# Altium schematic sheet Main_Buck.SchDoc: Buck Converter 60W 20V
size A4; Date: 25 FEB 2024; Author: Arturo S. Bayangos; Revision: V1.0; SheetNumber: 2; SheetTotal: 4
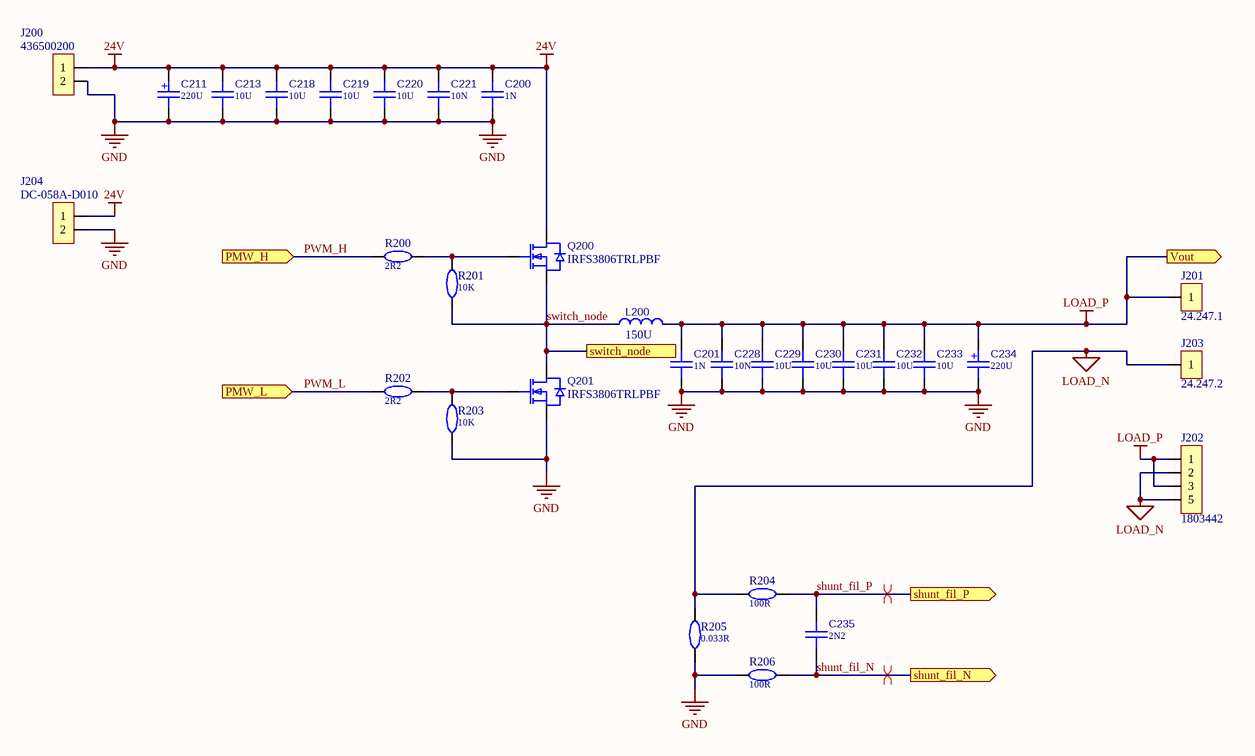
[diagram p0: Main_Buck.SchDoc]

## Parts
C200  value 1N  [CAP_0402]  (hidden comment: CAPACITOR)
C201  value 1N  [CAP_0402]  (hidden comment: CAPACITOR)
C211  value 220U  [CAP_SMD_UUD1H221MNL1GS]  (hidden comment: CAPACITOR_POLARIZED)
C213  value 10U  [CAP_1210]  (hidden comment: CAPACITOR)
C218  value 10U  [CAP_1210]  (hidden comment: CAPACITOR)
C219  value 10U  [CAP_1210]  (hidden comment: CAPACITOR)
C220  value 10U  [CAP_1210]  (hidden comment: CAPACITOR)
C221  value 10N  [CAP_0402]  (hidden comment: CAPACITOR)
C228  value 10N  [CAP_0402]  (hidden comment: CAPACITOR)
C229  value 10U  [CAP_1210]  (hidden comment: CAPACITOR)
C230  value 10U  [CAP_1210]  (hidden comment: CAPACITOR)
C231  value 10U  [CAP_1210]  (hidden comment: CAPACITOR)
C232  value 10U  [CAP_1210]  (hidden comment: CAPACITOR)
C233  value 10U  [CAP_1210]  (hidden comment: CAPACITOR)
C234  value 220U  [CAP_SMD_UUD1H221MNL1GS]  (hidden comment: CAPACITOR_POLARIZED)
C235  value 2N2  [CAP_0603]  (hidden comment: CAPACITOR)
J200  value 436500200  [CON_436500200]  (hidden comment: JACK_2P)
J201  value 24.247.1  [BANANA_JACK_RED_24.247.1]  (hidden comment: JACK_1P)
J202  value 1803442  [CON_1803442]  (hidden comment: JACK_4P)
J203  value 24.247.2  [BANANA_JACK_BLACK_24.247.2]  (hidden comment: JACK_1P)
J204  value DC-058A-D010  [CON_DC-058A-D010]  (hidden comment: JACK_2P)
L200  value 150U  [IND_74437429203151]  (hidden comment: INDUCTOR)
Q200  value IRFS3806TRLPBF  [D2PAK]  (hidden comment: MOSFET_NCHANNEL)
Q201  value IRFS3806TRLPBF  [D2PAK]  (hidden comment: MOSFET_NCHANNEL)
R200  value 2R2  [RES_0603]  (hidden comment: RESISTOR)
R201  value 10K  [RES_0603]  (hidden comment: RESISTOR)
R202  value 2R2  [RES_0603]  (hidden comment: RESISTOR)
R203  value 10K  [RES_0603]  (hidden comment: RESISTOR)
R204  value 100R  [RES_0603]  (hidden comment: RESISTOR)
R205  value 0.033R  [RES_1210]  (hidden comment: RESISTOR)
R206  value 100R  [RES_0603]  (hidden comment: RESISTOR)

## Ports
PMW_H (in), PMW_L (in), shunt_fil_N (out), shunt_fil_P (out), switch_node, Vout (out)

## Nets
24V: C200.2 C211.1 C213.1 C218.1 C219.1 C220.1 C221.2 J200.1 J204.1 Q200.4(D)
GND: C200.1 C201.2 C211.2 C213.2 C218.2 C219.2 C220.2 C221.1 C228.1 C229.2 C230.2 C231.2 C232.2 C233.2 C234.2 J200.2 J204.2 Q201.3(S) R203.1 R205.1 R206.1
LOAD_N: J202.2 J202.4(5) J203.1 R204.1 R205.2
LOAD_P: C201.1 C228.2 C229.1 C230.1 C231.1 C232.1 C233.1 C234.1 J201.1 J202.1 J202.3 L200.2 ; port Vout
PWM_H: R200.1 ; port PMW_H
PWM_L: R202.1 ; port PMW_L
shunt_fil_N: C235.1 R206.2 ; port shunt_fil_N
shunt_fil_P: C235.2 R204.2 ; port shunt_fil_P
switch_node: L200.1 Q200.3(S) Q201.4(D) R201.1 ; port switch_node
NetQ200_1: Q200.1(G) R200.2 R201.2
NetQ201_1: Q201.1(G) R202.2 R203.2

## Layout directives
differential pair: shunt_fil_N, shunt_fil_P

## Notes on the sheet
- Title:
- Revision:
- Variant:
- Size:
- Author:
- A4
- ASB
- Date:
- Sheet:
- of
- (in symbol UUD1H221MNL1GS) +

## Library data of the parts
C200 C201 = UMF105B7102KVHF: CAP 1N 0402 X7R 50V 10%; Manifacturer: Taiyo Yuden; Part Number: UMF105B7102KVHF; ComponentLink1Description: Datasheet; ComponentLink1URL: https://datasheet.lcsc.com/lcsc/1912111437_Taiyo-Yuden-UMF105B7102KVHF_C386104.pdf; ComponentLink2Description: Characteristics; ComponentLink2URL: Datasheets\Capacitors\UMF105B7102KVHF_TaiyoYuden.pdf; Package: 0402
C211 C234 = UUD1H221MNL1GS: CAP 220U SMD_D10mm_L10mm ELEC 50V 20%; Manifacturer: Nichicon; Part Number: UUD1H221MNL1GS; ComponentLink1Description: Datasheet; ComponentLink2Description: Characteristics; Package: SMD_D10mm_L10mm
C213 C218-C220 C229-C233 = UMK325AB7106KM-T: CAP 10U 1210 X7R 50V 10%; Manifacturer: Taiyo Yuden; Part Number: UMK325AB7106KM-T; ComponentLink1Description: Datasheet; ComponentLink1URL: https://datasheet.lcsc.com/lcsc/2211282230_Taiyo-Yuden-UMK325AB7106KM-T_C386167.pdf; ComponentLink2Description: Characteristics; ComponentLink2URL: Datasheets\Capacitors\UMK325AB7106KM-T_TaiyoYuden_Char.pdf; Package: 1210
C221 C228 = UMF105B7103KVHF: CAP 10N 0402 X7R 50V 10%; Manifacturer: Taiyo Yuden; Part Number: UMF105B7103KVHF; ComponentLink1Description: Datasheet; ComponentLink1URL: https://datasheet.lcsc.com/lcsc/1912111437_Taiyo-Yuden-UMF105B7103KVHF_C386105.pdf; ComponentLink2Description: Characteristics; ComponentLink2URL: Datasheets\Capacitors\UMF105B7103KVHF_TaiyoYuden.pdf; Package: 0402
C235 = C1608C0G2E222JT000N: CAP 2N2 0603 NPO 250V 5%; Manifacturer: TDK; Part Number: C1608C0G2E222JT000N; ComponentLink1Description: Datasheet; ComponentLink1URL: https://datasheet.lcsc.com/lcsc/2304140030_TDK-C1608C0G2E222JT000N_C694281.pdf; ComponentLink2Description: Characteristics; Package: 0603
J200 = 436500200: RECEP 436500200 TH 3mm HORIZ; Pitch: NA; Voltage: 600V; Current: 8.5A; Structure: RERCEP 2WIRE HORIZ; Manifacturer: MOLEX; ComponentLink1Description: Datasheet; ComponentLink1URL: https://datasheet.lcsc.com/lcsc/2305301754_MOLEX-436500200_C192562.pdf; Part Number: 436500200; Package: TH; Supported protocol: NA
J201 = 24.247.1: JACK  24.247.1 TH 4mm  VERT RED; Pitch: NA; Voltage: 60V; Current: 32A; Structure: VERT RED BANANA JACK; Manifacturer: Changzhou Amass Elec; ComponentLink1Description: Datasheet; ComponentLink1URL: https://www.lcsc.com/product-detail/Banana-Connectors-Alligator-Clips_Changzhou-Amass-Elec-24-247-2_C106272.html; Part Number: 24.247.1; Package: TH; Supported protocol: NA
J202 = 1803442: RECEP 1803442 TH 3.81mm HORIZ; Voltage: 160V; Current: 8A; Structure: RECEP 4WIRE VERT; Supported protocol: NA; Manifacturer: Phoenix Contact; ComponentLink1Description: Datasheet; ComponentLink1URL: https://datasheet.lcsc.com/lcsc/2001071235_Phoenix-Contact-1803442_C480518.pdf; Part Number: 1803442; Package: TH; Pitch: 3.81mm
J203 = 24.247.2: JACK  24.247.2 TH 4mm  VERT BLACK; Pitch: NA; Voltage: 60V; Current: 32A; Structure: VERT BLACK BANANA JACK; Manifacturer: Changzhou Amass Elec; ComponentLink1Description: Datasheet; ComponentLink1URL: https://www.lcsc.com/product-detail/Banana-Connectors-Alligator-Clips_Changzhou-Amass-Elec-24-247-2_C106272.html; Part Number: 24.247.2; Package: TH; Supported protocol: NA
J204 = DC-058A-D010: JACK / DC-058A-D010 TH  HORIZ; Pitch: NA; Voltage: 12V; Current: 5A; Structure: HORZ 2WIRE Jack; Manifacturer: G-Switch; ComponentLink1Description: Datasheet; ComponentLink1URL: https://datasheet.lcsc.com/lcsc/2102241737_G-Switch-DC-058A-D010_C2686970.pdf; Part Number: DC-058A-D010; Package: TH; Supported protocol: NA
L200 = 74437429203151: IND 150U SMD_W25mm_L28mm 8.4A 7.8A; Manifacturer: Wurth Electronik; Part Number: 74437429203151; Irated: 8.4A; Isat: 7.8A; Package: SMD_W25mm_L28mm
Q200 Q201 = IRFS3806TRLPBF: NFET IRFS3806TRLPBF D2PAK 60V 43A 15.8mΩ; Rdson(max): 15.8mR; Tjmax: 175 °C; Manifacturer: Infineon Technologies; ComponentLink1Description: Datasheet; ComponentLink1URL: https://datasheet.lcsc.com/lcsc/2005292345_Infineon-Technologies-IRFS3806TRLPBF_C538013.pdf; ComponentLink2Description: Characteristics; Part Number: IRFS3806TRLPBF; Package: D2PAK; Voltage: 60V; Current (Tcase = 25°C): 43A
R200 R202 = 0603WAJ022JT5E: RES 2R2 0603 0.1W 5% 75V; Manifacturer: UNI-ROYAL; Part Number: 0603WAJ022JT5E; ComponentLink1Description: Datasheet; ComponentLink1URL: Datasheets\Resistors\0603WAJ022JT5E_UniRoyal.pdf; ComponentLink2Description: Characteristics; Package: 0603
R201 R203 = ARG03BTC1002: RES 10K 0603 0.1W 0.1% 75V; Manifacturer: Viking Tech; Part Number: ARG03BTC1002; ComponentLink1Description: Datasheet; ComponentLink1URL: Datasheets\Resistors\ARG03BTC1002_VikingTech.pdf; ComponentLink2Description: Characteristics; Package: 0603
R204 R206 = RT0603CRE07100RL: RES 100R 00603 0.1W 0.25% 75V; Manifacturer: YAGEO; Part Number: RT0603CRE07100RL; ComponentLink1Description: Datasheet; ComponentLink1URL: Datasheets\Resistors\RT0603CRE07100RL_Yageo.pdf; ComponentLink2Description: Characteristics; Package: 0603
R205 = RTT12R033FTP: RES 0.033R 1210 1% 0.5W 200V; Manifacturer: RALEC; Part Number: RTT12R033FTP; ComponentLink1Description: Datasheet; ComponentLink1URL: Datasheets\Resistors\RTT12R033FTP_Ralec.pdf; ComponentLink2Description: Characteristics; Package: 1210